# EAGLE design DotBlue (EAGLE 7.7.0)
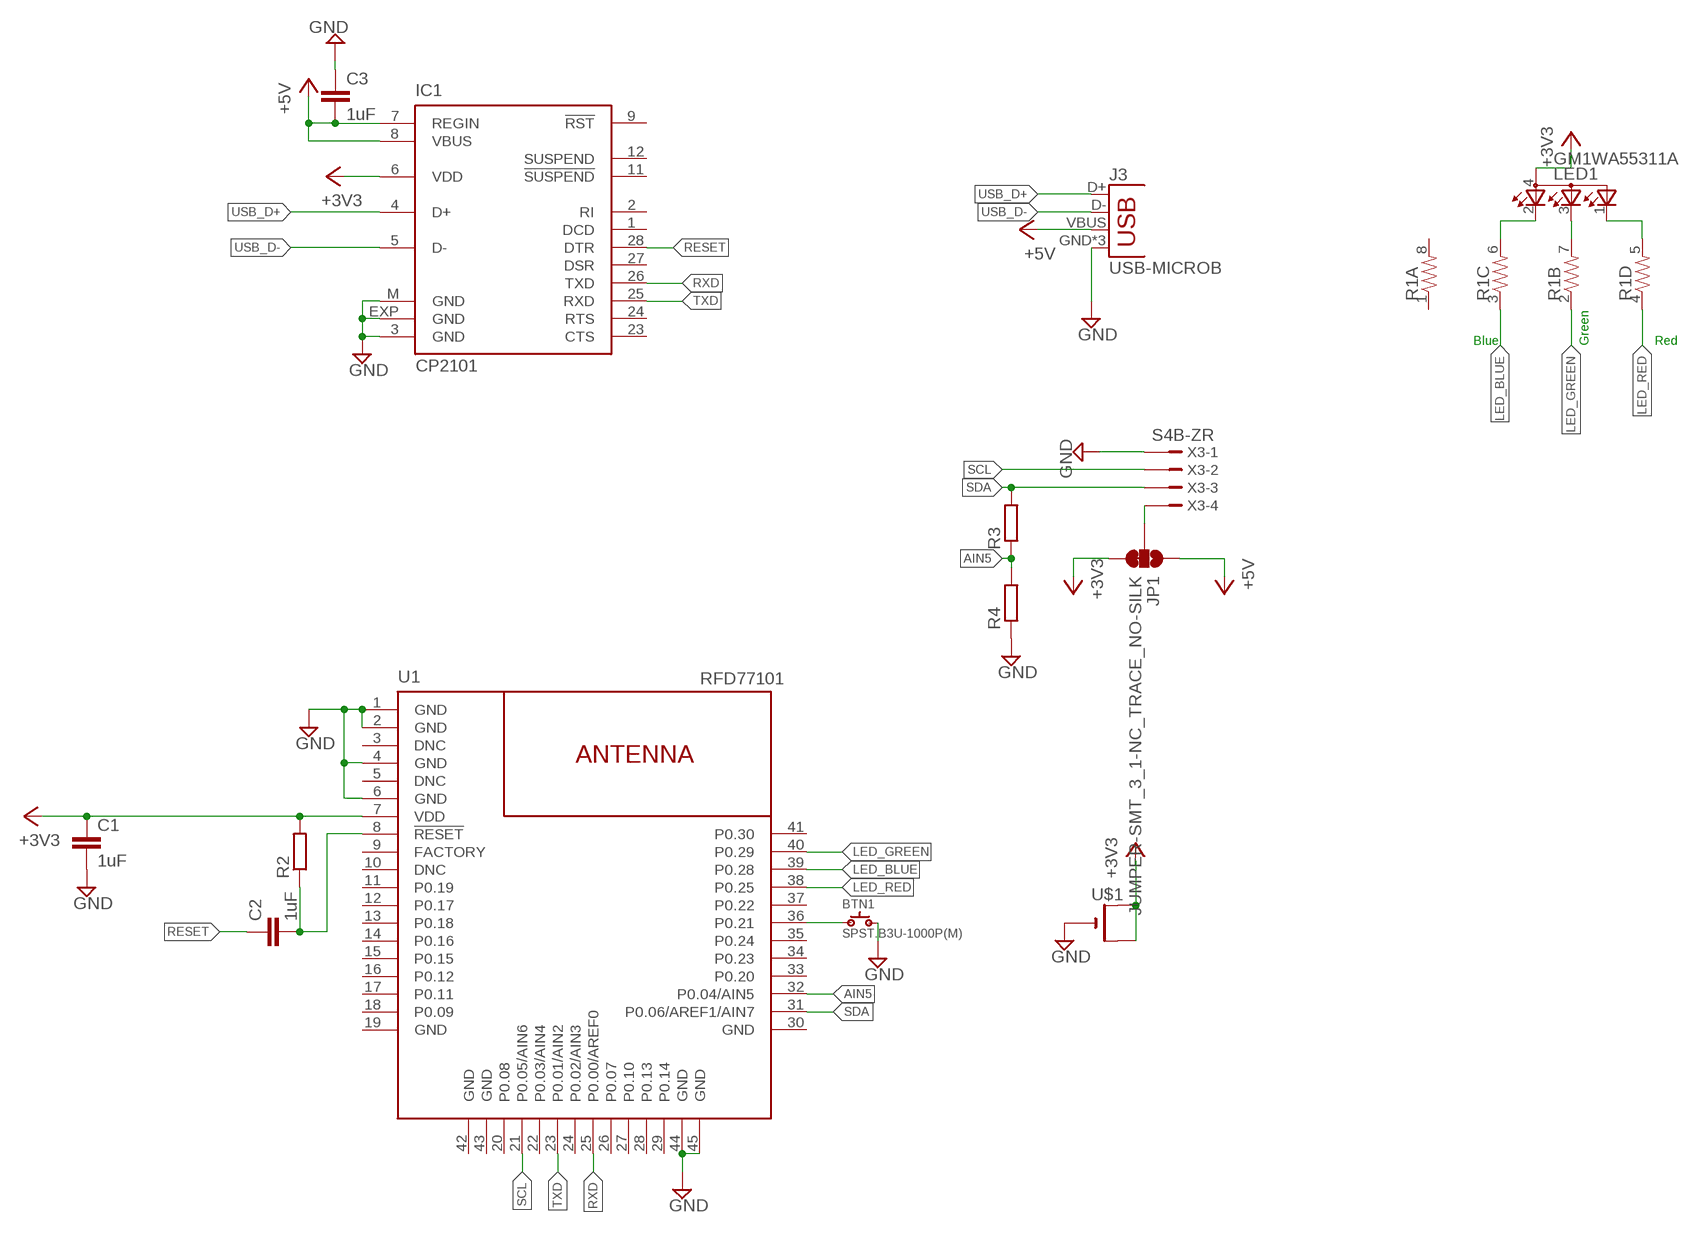
[diagram p0: schematic, sheet 1]

## Parts
BTN1  SPST.B3U-1000P(M)  [B3U-1000P(M)]
C1  1uF  C-EUC0603  [C0603]
C2  1uF  C-EUC0603  [C0603]
C3  1uF  C-EUC0603  [C0603]
IC1  CP2101  [MLP28]
J3  USB-MICROB  [USB-MICROB]
JP1  JUMPER-SMT_3_1-NC_TRACE_NO-SILK  [SMT-JUMPER_3_1-NC_TRACE_NO-SILK]
LED1  GM1WA55311A  [GM1WA55311A]
R1  RESISTOR-ARRAY0603-ARV  [0603-ARV]
R2  R-EU_R0603  [R0603]
R3  R-EU_R0603  [R0603]
R4  R-EU_R0603  [R0603]
U1  RFD77101  [RFD77101]
U$1  CR1220SMT  [CR1220-SMD]
X3  S4B-ZR  [S4B-ZR]

## Nets
+3V3: C1.1 IC1.6(VDD) JP1.3 LED1.4(A) R2.2 U1.7(VDD) U$1.+$1(+) U$1.+$2(+1)
+5V: C3.2 IC1.7(REGIN) IC1.8(VBUS) J3.VBUS JP1.1
AIN5: R3.1 R4.2 U1.32(P0.04/AIN5)
GND: BTN1.2 C1.2 C3.1 IC1.3(GND) IC1.EXP(GND) IC1.M(GND) J3.GND J3.MT1(GND) J3.MT2(GND) R4.1 U1.1(GND) U1.2(GND) U1.4(GND) U1.6(GND) U1.44(GND) U1.45(GND) U$1.- X3.1
LED_BLUE: R1.3 U1.39(P0.28)
LED_GREEN: R1.2 U1.40(P0.29)
LED_RED: R1.4 U1.38(P0.25)
N$1: LED1.3(CBLUE) R1.7
N$2: C2.2 R2.1 U1.8(!RESET!)
N$3: BTN1.1 U1.36(P0.21)
N$4: LED1.2(CRED) R1.6
N$5: JP1.2 X3.4
N$15: LED1.1(CGREEN) R1.5
RESET: C2.1 IC1.28(DTR)
RXD: IC1.26(TXD) U1.25(P0.00/AREF0)
SCL: U1.21(P0.05/AIN6) X3.2
SDA: R3.2 U1.31(P0.06/AREF1/AIN7) X3.3
TXD: IC1.25(RXD) U1.23(P0.01/AIN2)
USB_D+: IC1.4(D+) J3.D+
USB_D-: IC1.5(D-) J3.D-
Unconnected: IC1.1(DCD) IC1.2(RI) IC1.9(!RST) IC1.11(!SUSPEND) IC1.12(SUSPEND) IC1.23(CTS) IC1.24(RTS) IC1.27(DSR) R1.1 R1.8 U1.3(DNC) U1.5(DNC) U1.9(FACTORY) U1.10(DNC) U1.11(P0.19) U1.12(P0.17) U1.13(P0.18) U1.14(P0.16) U1.15(P0.15) U1.16(P0.12) U1.17(P0.11) U1.18(P0.09) U1.20(P0.08) U1.22(P0.03/AIN4) U1.24(P0.02/AIN3) U1.26(P0.07) U1.27(P0.10) U1.28(P0.13) U1.29(P0.14) U1.33(P0.20) U1.34(P0.23) U1.35(P0.24) U1.37(P0.22) U1.41(P0.30)

## Notes on the sheet
- Blue | Green | Red

## Power pins joined to a net without a drawn wire
GND: U1.19(GND) U1.30(GND) U1.42(GND) U1.43(GND)

## Library data of the parts
BTN1 = omron:SPST
C1-C3 = rcl:C-EU: CAPACITOR, European symbol
IC1 = silabs:CP210*: Single-Chip USB to UART Bridge Source: www.silabs.com .. CP2101.pdf / cp2102.pdf; MF: FARNELL; MPN: CP2102-GM; OC_FARNELL: 9282130; OC_NEWARK: 30K5635
J3 = SparkFun-Retired:USB: USB Connectors USB-B-PTH is fully proven SKU : PRT-00139/CONN-08278 USB-miniB is fully proven SKU : PRT-00587 USB-A-PCB is untested. USB-A-H is throughly reviewed, but untested. Spark Fun Electronics SKU : PRT-00437 USB-B-SMT is throughly reviewed, but untested. Needs silkscreen touching up. USB-A-S has not been used/tested USB-MB-H has not been used/tested USB-MICROB has been used. CONN-09505; PROD_ID: CONN-09505
JP1 = SparkFun-Jumpers:JUMPER-SMT_3_1-NC_TRACE: Normally closed trace jumper (1 of 2 connections) This jumper has a trace between two pads so it's normally closed (NC). The other connection is normally open (NO). Use a razor knife to open the connection. For best results follow the IPC guidelines for cutting traces: Cutout at least 0.063 mm (0.005 in). Remove all loose material to clean up the cut area. Seal the cut with an approved epoxy. Reapply solder to reclose the connection, or to close the NO connection.
LED1 = led:GM1WA55311A: Chip LED RGB Source: http://document.sharpsma.com/files/GM1WA55311A_SS.pdf
R1 = SparkFun:RESISTOR-ARRAY: Array Chip Resistor Source: RS Component / Phycomp
R2-R4 = rcl:R-EU_: RESISTOR, European symbol
U1 = SparkFun-RF:RFD77101: Simblee  BLE Module RFD77101 © 2015 RF Digital Corporation Datasheet <https://cdn.sparkfun.com/datasheets/IoT/Simblee%20RFD77101%20Datasheet%20v1.0.pdf> PATENTS PENDING 04.01.2015 Bluetooth Smart radio transceiver, ARM Cortex M0 microcontroller. 128kB Flash, 24kB RAM, no EEPROM Arduino-compatible. SparkFun Products: Simblee BLE Module - RFD77101 <https://www.sparkfun.com/products/13808> SparkFun Simblee BLE Breakout - RFD77101 <https://www.sparkfun.com/products/13632>; PROD_ID: COMP-13237; SF_ID: WRL-13808
U$1 = adafruit:CR1220: CR1216/CR1220/CR1225 12mm 3V lithium coin cell Great for battery packup. Both SMT and THM holders. Note the THM package has the ground pads on both sides of the PCB so that the masks are the same - this reduces the cost
X3 = con-jst:?4B-ZR: ZH CONNECTOR 1.5 mm, 4 pin 1 row Source: http://www.jst.com .. eZH.pdf; MF: FARNELL; MPN: S4B-ZR(LF)(SN); OC_FARNELL: 9491830; OC_NEWARK: 38K8076

## Board
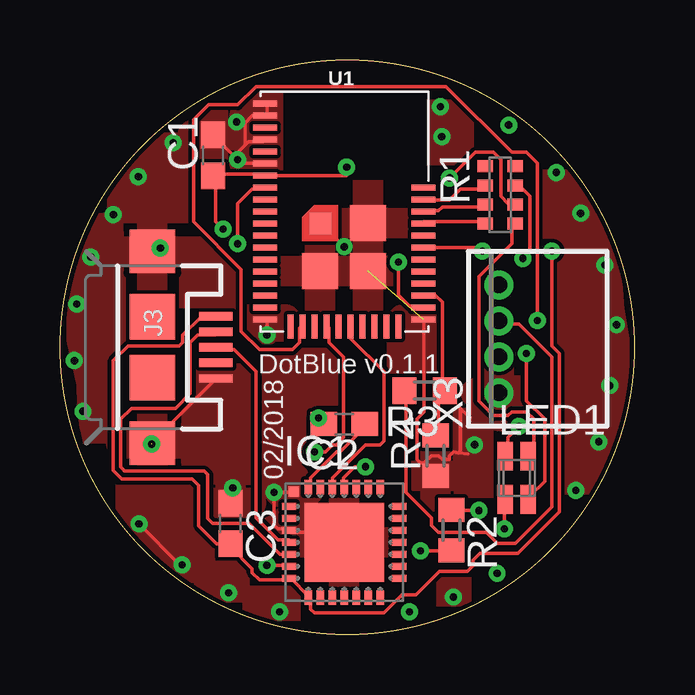
[diagram p1: board, top side]
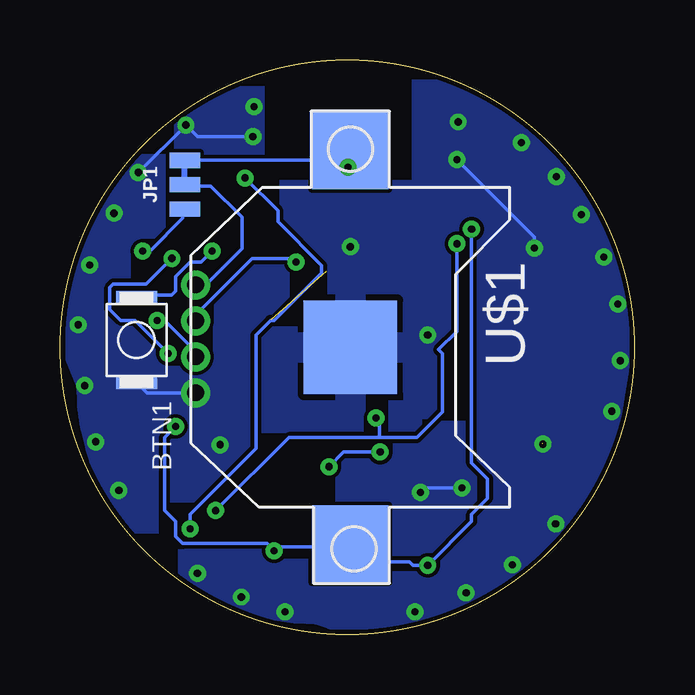
[diagram p2: board, bottom side, seen from below]

Size 23.96 x 23.96 mm. Coordinates in mm from the lower left corner, seen from the top.
Outline: circle at 11.98,11.98 radius 11.98
Copper layers (1*16): Top 0.035mm / dielectric 1.5mm / Bottom 0.035mm
Design rules "default": minimum track width 6mil, minimum drill 0.3mm, track to track 6mil, track to pad 6mil, pad to pad 6mil, via to via 6mil, smd to smd 6mil, copper to edge 8mil, drill to drill 8mil, minimum pad ring 10mil, minimum via ring 8mil, stop-mask expansion 4mil, vias tented up to drill 0mil, thermal gap 10mil
tRestrict: area 9.3,19 to 15.3,22.6
bRestrict: area 9.3,19 to 15.4,22.6

### Footprints (pad centres in the part's own frame; a part is rotated, then mirrored left to right if it is on the bottom)
B3U-1000P(M) = smd 0.6 x 1.7: 1 -1.75,0; 2 1.75,0
C0603 = smd 1.1 x 1: 1 -0.85,0; 2 0.85,0
MLP28 = smd 0.6 x 0.3: 1 -2.3,1.5; 2 -2.3,1; 3 -2.3,0.5; 4 -2.3,0; 5 -2.3,-0.5; 6 -2.3,-1; 7 -2.3,-1.5; 15 2.3,-1.5; 16 2.3,-1; 17 2.3,-0.5; 18 2.3,0; 19 2.3,0.5; 20 2.3,1; 21 2.3,1.5 | smd 0.3 x 0.6: 8 -1.5,-2.3; 9 -1,-2.3; 10 -0.5,-2.3; 11 0,-2.3; 12 0.5,-2.3; 13 1,-2.3; 14 1.5,-2.3; 22 1.5,2.3; 23 1,2.3; 24 0.5,2.3; 25 0,2.3; 26 -0.5,2.3; 27 -1,2.3; 28 -1.5,2.3 | smd 3.3 x 3.3: EXP 0,0 | smd 0.435 x 0.435: M -2.103,2.103
USB-MICROB = smd 0.35 x 1.4: D+ 0,2.65; D- -0.65,2.65; GND 1.3,2.65; ID 0.65,2.65; VBUS -1.3,2.65 | smd 1.8 x 1.9: MT1 -4,0; MT2 4,0 | smd 1.9 x 1.9: P$1 -1.27,0; P$2 1.27,0
SMT-JUMPER_3_1-NC_TRACE_NO-SILK = smd 0.635 x 1.27: 1 -1.016,0; 2 0,0; 3 1.016,0
GM1WA55311A = smd 0.65 x 1.2: 1 0.477,0.9; 2 -0.475,-0.9; 3 0.475,-0.9; 4 -0.477,0.9
0603-ARV = smd 0.5 x 0.65: 1 -1.2,-0.625; 2 -0.4,-0.625; 3 0.4,-0.625; 4 1.2,-0.625; 5 1.2,0.625; 6 0.4,0.625; 7 -0.4,0.625; 8 -1.2,0.625
R0603 = smd 1 x 1.1: 1 -0.85,0; 2 0.85,0
RFD77101 = smd 1 x 0.254: 1 0,0; 2 0,-0.5; 3 0,-1; 4 0,-1.5; 5 0,-2; 6 0,-2.5; 7 0,-3; 8 0,-3.5; 9 0,-4; 10 0,-4.5; 11 0,-5; 12 0,-5.5; 13 0,-6; 14 0,-6.5; 15 0,-7; 16 0,-7.5; 17 0,-8; 18 0,-8.5; 19 0,-9; 30 6.61,-9; 31 6.61,-8.5; 32 6.61,-8; 33 6.61,-7.5; 34 6.61,-7; 35 6.61,-6.5; 36 6.61,-6; 37 6.61,-5.5; 38 6.61,-5; 39 6.61,-4.5; 40 6.61,-4; 41 6.61,-3.5 | smd 0.254 x 1: 20 1.055,-9.29; 21 1.555,-9.29; 22 2.055,-9.29; 23 2.555,-9.29; 24 3.055,-9.29; 25 3.555,-9.29; 26 4.055,-9.29; 27 4.555,-9.29; 28 5.055,-9.29; 29 5.555,-9.29 | smd 0.9 x 0.9: 42 2.3,-4.99 | smd 1.5 x 1.5: 43 2.3,-6.99; 44 4.3,-6.99; 45 4.3,-4.99
CR1220-SMD = smd 3.2 x 3.2: +$1 -8.2,0; +$2 8.2,0 | smd 3.9 x 3.9: - 0,0
S4B-ZR = drill 0.7 pad 1.1: 1 -2.25,0; 2 -0.75,0; 3 0.75,0; 4 2.25,0

### Placement (x,y rotation side)
BTN1  20.77,12.29 270 bottom
C1  6.39,19.98 90 top
C2  11.85,8.78 180 top
C3  7.1,4.64 270 top
IC1  11.85,3.85 0 top
J3  3.85,11.98 270 top
JP1  18.76,18.76 90 bottom
LED1  19.04,6.55 0 top
R1  18.36,18.33 270 top
R2  16.32,4.36 270 top
R3  15.21,10.18 180 top
R4  15.66,7.46 90 top
U1  8.55,22.14 0 top
U$1  11.85,11.98 270 bottom
X3  18.31,12.34 90 top

### Tracks (layer width: path | path; a pad name or v marks a point on that pad's centre or on a via)
+3V3  (via drill 0.3)
  Top 0.152: v8.63,2.89 9.54,2.89 IC1.6 | v15.03,3.5 16.25,3.5 R2.2 | v19.14,8.68 18.69,8.22 18.69,7.46 LED1.4 | v6.8,16.91 6.5,17.21 6.5,19.04 C1.1 6.5,19.2 8.48,19.2 U1.7 11.96,19.14 v11.96,19.5
  Bottom 0.152: v19.14,8.68 19.6,8.22 19.6,5.17 19.14,4.72 19.14,4.11 18.84,3.8 15.33,3.8 v15.03,3.5 14.88,3.65 11.98,3.65 U$1.+$2 11.83,3.65 11.22,3.04 9.39,3.04 9.24,2.89 v8.63,2.89 6.8,4.72 6.8,5.02 6.14,5.68 6.14,6.5 6.8,7.16 v6.8,16.91 | U$1.+$1 11.85,19.5 v11.96,19.5 11.96,19.78 JP1.3
+5V  (via drill 0.3)
  Top 0.152: C3.2 7.1,3.65 8.02,2.74 8.02,2.58 8.32,2.28 9.54,2.28 IC1.7 9.7,2.28 10.31,1.67 IC1.8 10.46,1.52 10.46,1.06 10.61,0.91 13.51,0.91 14.27,1.67 14.85,1.67 15.82,2.63 16.99,2.63 17.21,2.86 17.21,3.09 17.52,3.4 19.09,3.4 20.82,5.12 20.82,11.73 20.52,12.03 v20.52,15.99 | J3.VBUS 6.5,13.25 5.89,13.25 5.12,12.49 5.12,12.18 4.97,12.03 2.84,12.03 2.23,11.42 2.23,6.85 2.58,6.5 5.5,6.5 5.78,6.22 5.78,4.54 6.53,3.79 C3.2 | 7.1,3.8 C3.2
  Bottom 0.152: v20.52,15.99 20.21,15.99 18.84,17.37 18.84,17.67 JP1.1
AIN5
  Top 0.152: U1.32 15.18,14.17 15.64,14.17 15.94,13.86 15.94,10.2 R3.1 15.94,10.05 15.79,9.9 15.79,8.37 R4.2
GND  (via drill 0.3)  (2 unrouted)
  Top 0.152: 9.09,5.78 8.93,5.63 8.93,4.56 9.09,4.41 9.54,4.41 IC1.3 9.7,4.26 11.52,4.26 11.83,3.96 IC1.EXP | 9.09,5.78 9.24,5.94 9.7,5.94 IC1.M | U1.1 8.63,22.09 8.63,21.63 U1.2 8.48,21.63 8.02,21.63 7.71,21.33 7.71,20.41 | 7.26,19.96 6.5,20.72 C1.2 | 7.26,19.96 v7.41,19.8 7.56,19.65 8.48,19.65 U1.6 | 7.26,19.96 7.71,20.41 | 7.71,20.41 7.87,20.57 8.48,20.57 U1.4 | v8.63,12.49 8.63,13.1 U1.19 | U1.30 15.18,13.1 15.18,9.29 14.88,8.98 14.88,7.31 15.03,7.16 15.18,7.16 15.49,7.46 15.79,7.46 15.94,7.31 16.25,7.31 16.25,7.46 16.4,7.61 16.61,7.58 | 16.61,7.58 17,7.53 | J3.GND 6.5,10.66 3.9,8.07 J3.MT2 | v8.93,5.94 9.09,5.78 | 17.1,9.05 16.71,9.44 16.71,7.68 16.61,7.58 | U1.42 10.88,17.15 v11.85,16.17 | J3.MT1 4.04,15.98 v4.18,16.12 | C3.1 7.19,5.49 v7.21,6.11 | v3.29,4.62 5,2.91 v5.1,2.91
  Bottom 0.152: v4.18,16.12 4.18,16.58 v7.41,19.8 | X3.1 20.32,10.09 BTN1.2 | v7.21,6.11 8.63,6.11 8.83,5.91 8.91,5.91 v8.93,5.94 | v15.92,20.77 18.23,20.77 v18.71,21.25 v20.69,19.27
  other vias: 3.83,7.94 17.29,7.92 7.36,21.38 4.72,20.52 3.27,19.09 2.23,17.52 1.29,15.74 0.7,13.78 0.6,11.42 0.96,9.31 7.03,1.74 9.16,0.96 14.57,0.96 16.4,1.57 18.23,2.56 21.51,6.01 22.47,8.04 22.93,10.38 23.21,12.92 22.73,15.41 21.71,17.57 15.87,22.01
  pour Bottom: 12.74,23.16 arc-90 23.16,11.73 22.65,10.46 arc-90 13.25,1.06 12.49,0.81 arc-90 1.06,9.95 0.55,13 arc-90 11.98,22.9
  pour Top: 11.73,23.16 13,22.9 arc-90 22.9,13.51 23.31,11.14 arc-90 11.22,0.81 10.71,0.81 arc-90 1.31,10.46 0.81,12.74 arc-90
LED_BLUE
  Top 0.152: R1.3 17.62,17.82 15.94,17.82 15.79,17.67 15.18,17.67 U1.39
LED_GREEN
  Top 0.152: R1.2 17.62,18.59 16.71,18.59 16.25,18.13 15.18,18.13 U1.40
LED_RED
  Top 0.152: R1.4 17.62,17.21 15.18,17.21 U1.38
N$1  (via drill 0.3)
  Top 0.152: v19.3,15.69 19.6,15.99 19.6,18.28 19.3,18.59 18.99,18.59 R1.7 | v19.45,11.73 19.45,9.75 20.21,8.98 20.21,6.39 19.6,5.78 LED1.3
  Bottom 0.152: v19.3,15.69 20.36,14.62 21.74,14.62 21.89,14.47 21.89,13.56 21.43,13.1 20.82,13.1 v19.45,11.73
N$2  (via drill 0.3)
  Top 0.152: v7.41,16.3 7.41,17.98 8.02,18.59 8.48,18.59 U1.8 | C2.2 10.91,8.83 10.79,8.83 v10.79,9.04 | v17.47,5.17 16.4,5.17 R2.1
  Bottom 0.152: v7.41,16.3 7.41,12.64 8.17,11.88 8.02,11.73 8.02,9.29 9.09,8.22 10.64,8.22 | v17.47,5.17 14.42,8.22 10.64,8.22 | v10.79,9.04 10.64,9.04 10.64,8.22
N$3  (via drill 0.3)
  Top 0.152: v17.62,15.99 17.47,16.15 15.18,16.15 U1.36
  Bottom 0.152: v17.62,15.99 18.08,15.54 18.53,15.54 19.14,14.93 19.14,14.32 19.3,14.17 20.67,14.17 BTN1.1
N$4  (via drill 0.3)
  Top 0.152: v16.25,19.04 17.32,20.11 18.08,20.11 18.38,19.8 18.38,18.28 18.69,17.98 18.84,17.98 R1.6 | v18.53,4.41 18.53,5.63 LED1.2
  Bottom 0.152: v16.25,19.04 14.88,17.67 14.88,17.21 13.05,15.39 13.05,15.08 15.03,13.1 15.18,13.1 15.79,12.49 15.79,7.77 18.53,5.02 v18.53,4.41
N$5
  Bottom 0.152: X3.4 17.88,14.59 16.38,16.1 16.38,17.42 17.67,18.71 18.71,18.71 JP1.2
N$15
  Top 0.152: R1.5 18.84,17.06 18.84,16.3 17.47,14.93 17.47,9.75 18.08,9.14 18.69,9.14 18.84,9.29 19.45,9.29 19.75,8.98 19.75,7.61 19.6,7.46 LED1.1
RESET
  Top 0.152: IC1.28 10.46,6.24 10.46,6.55 11.52,7.61 11.68,7.61 12.74,8.68 C2.1
RXD
  Top 0.152: IC1.26 11.37,6.24 11.37,6.55 12.74,7.92 13.35,7.92 13.51,8.07 13.51,10.97 12.13,12.34 12.13,12.79 U1.25
SCL  (via drill 0.3)
  Top 0.152: v19.91,13.1 19.91,19.65 19.45,20.11 18.84,20.11 16.1,22.85 8.17,22.85 7.41,22.09 6.19,22.09 5.58,21.48 5.58,17.21 7.56,15.23 7.56,12.64 8.32,11.88 9.7,11.88 10,12.18 10,12.79 U1.21
  Bottom 0.152: v19.91,13.1 19.75,13.25 18.23,11.73 X3.2
SDA  (via drill 0.3)
  Top 0.152: v14.12,15.54 14.12,14.17 14.57,13.71 15.03,13.71 U1.31 | R3.2 14.42,10.05 14.42,5.94 15.49,4.87 15.49,4.56 15.79,4.26 17.77,4.26 18.23,3.8 18.99,3.8 20.52,5.33 20.52,11.58 19.14,12.95 18.38,12.95 X3.3
  Bottom 0.152: v14.12,15.54 14.27,15.69 15.94,15.69 18.23,13.4 18.23,13.1 X3.3
TXD  (via drill 0.3)
  Top 0.152: v12.74,7 12.29,7 11.83,6.55 11.83,6.24 IC1.25 | v10.61,7.61 11.07,7.61 11.37,7.92 11.52,7.92 11.83,8.22 11.83,11.58 11.22,12.18 11.22,12.79 U1.23
  Bottom 0.152: v12.74,7 12.13,7.61 v10.61,7.61
USB_D+
  Top 0.152: IC1.4 9.54,3.96 9.09,3.96 8.17,4.87 8.17,10.97 7.26,11.88 6.65,11.88 J3.D+
USB_D-
  Top 0.152: 9.24,3.35 IC1.5 9.18,3.35 7.89,4.64 6.37,4.64 6.16,4.84 6.16,6.67 6.01,6.83 2.69,6.83 2.69,6.85 2.53,7 2.53,8.98 2.99,9.44 4.82,9.44 5.43,10.05 5.43,12.18 5.73,12.49 6.5,12.49 J3.D-

### Text on the board
tPlace: DotBlue v0.1.1 | 02/2018